# EAGLE schematic OLM-base-flora (EAGLE 6.4)
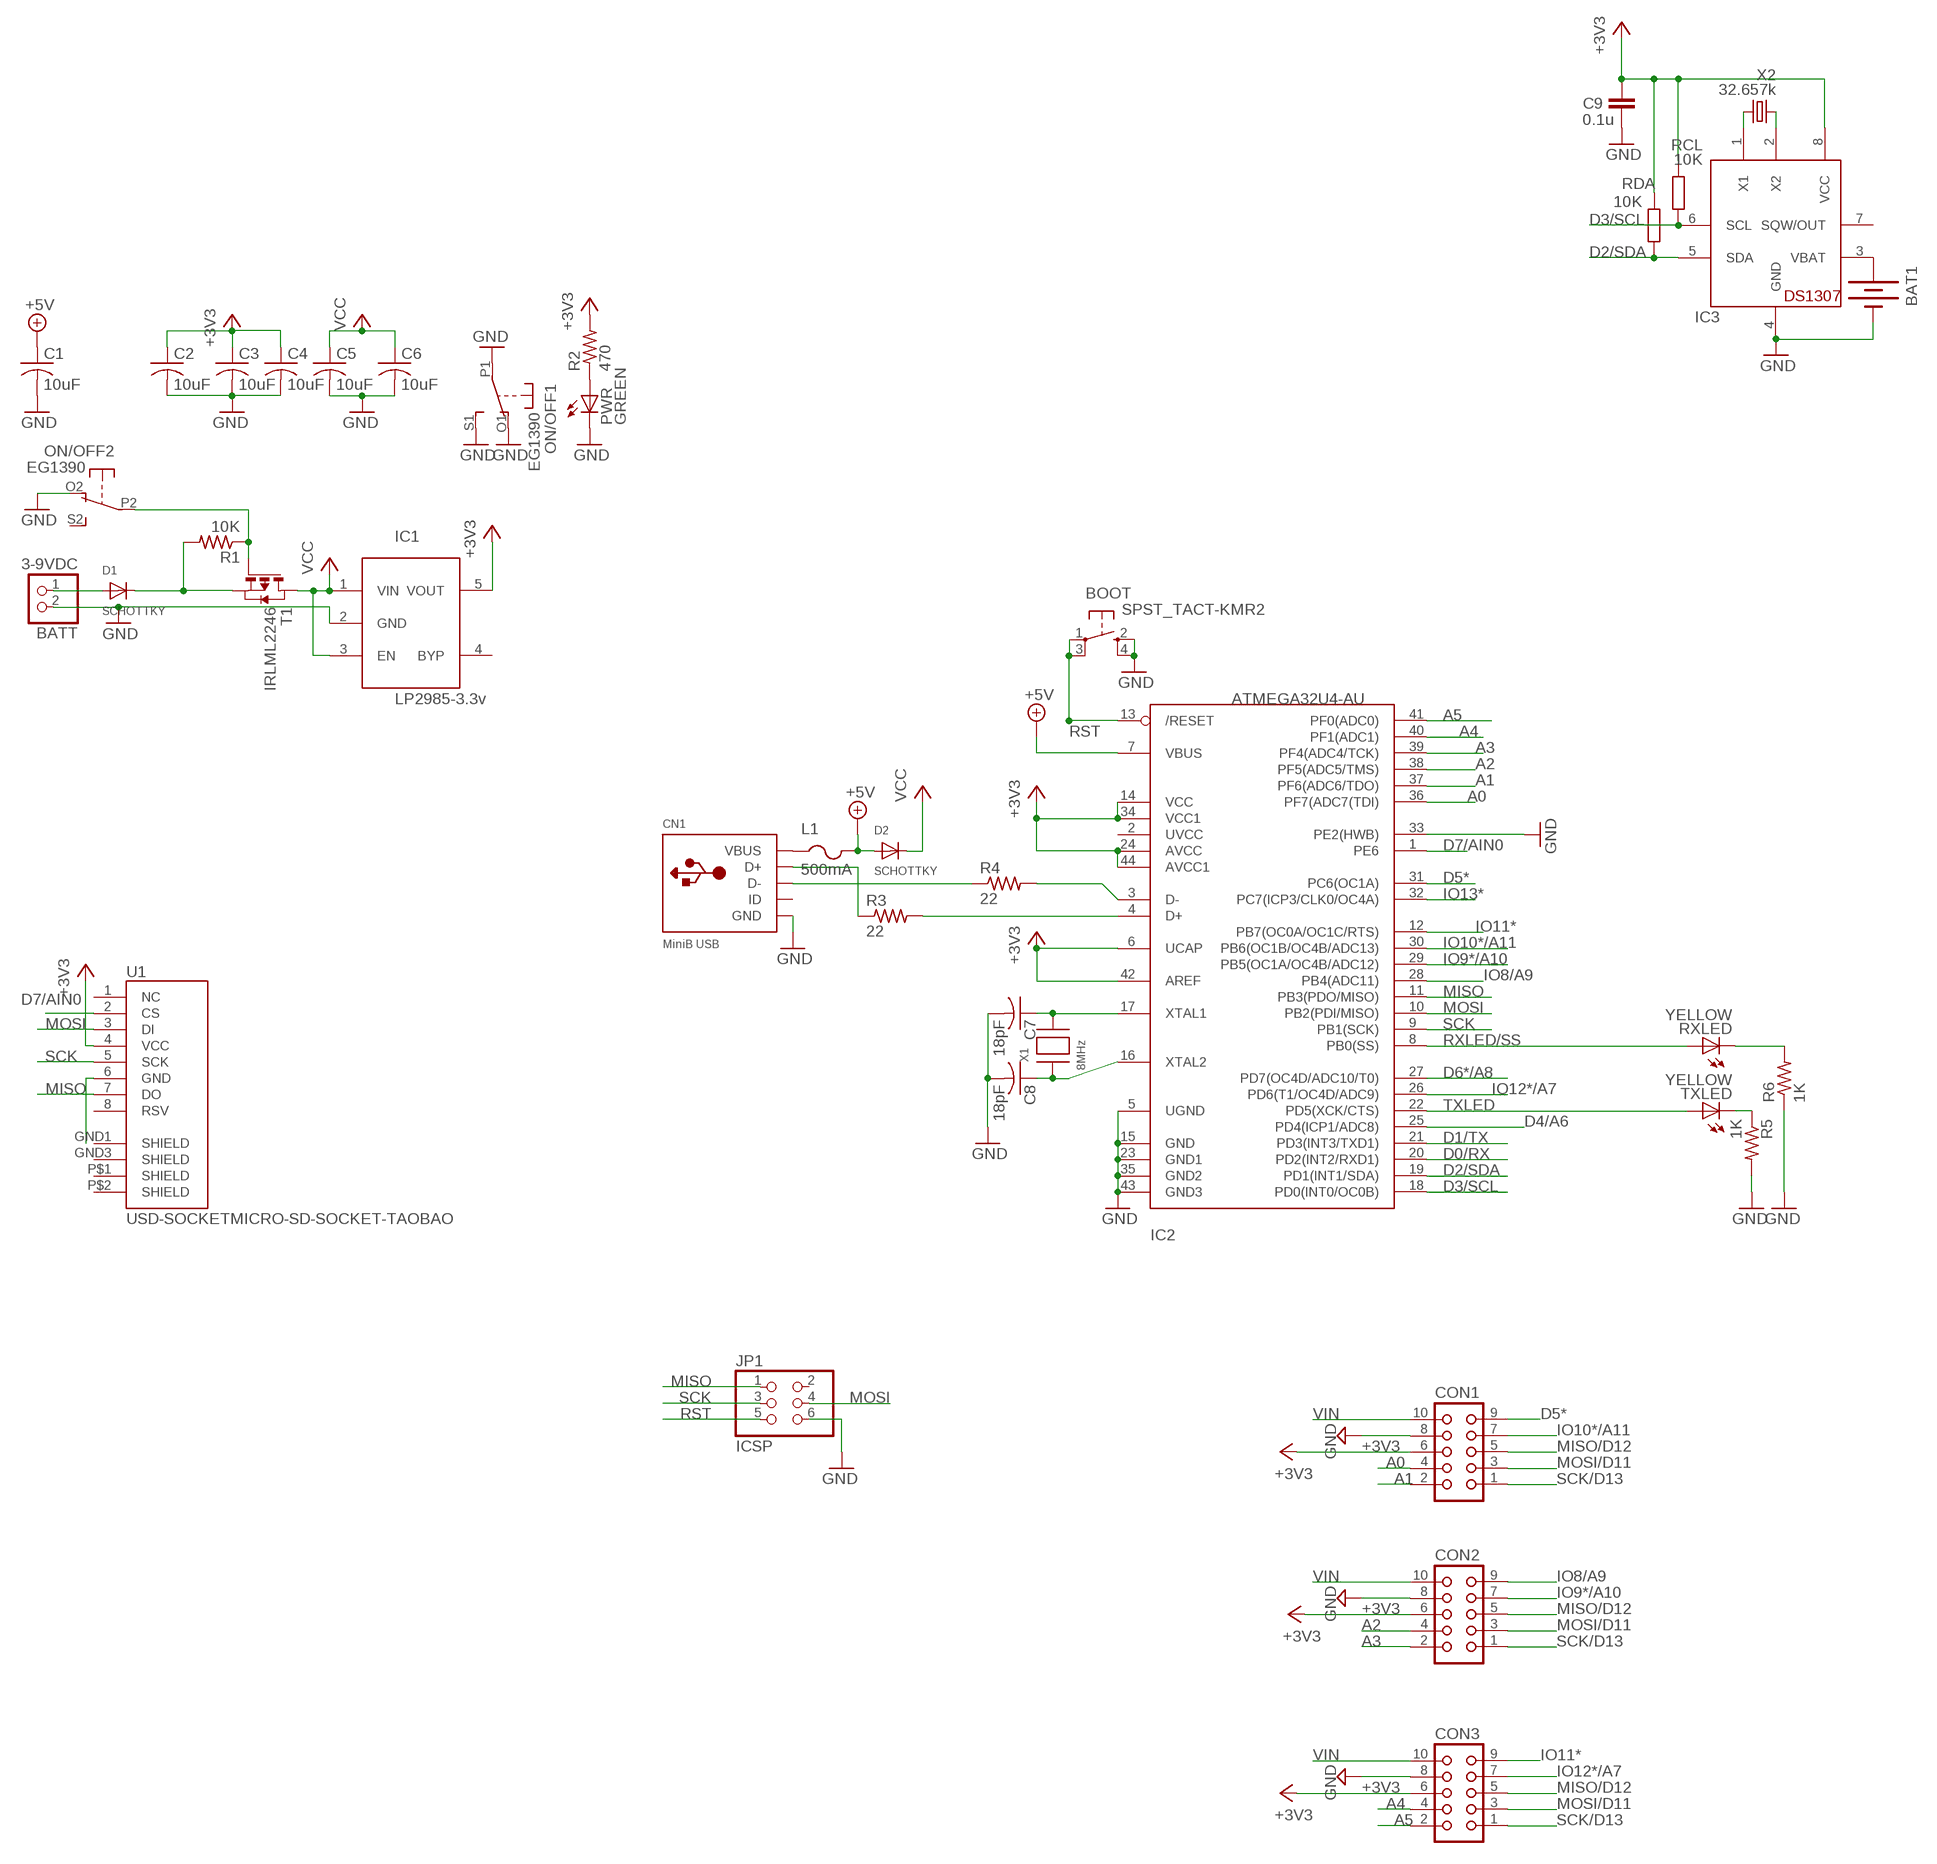
[diagram p0: schematic, sheet 1, part 1 of 2]
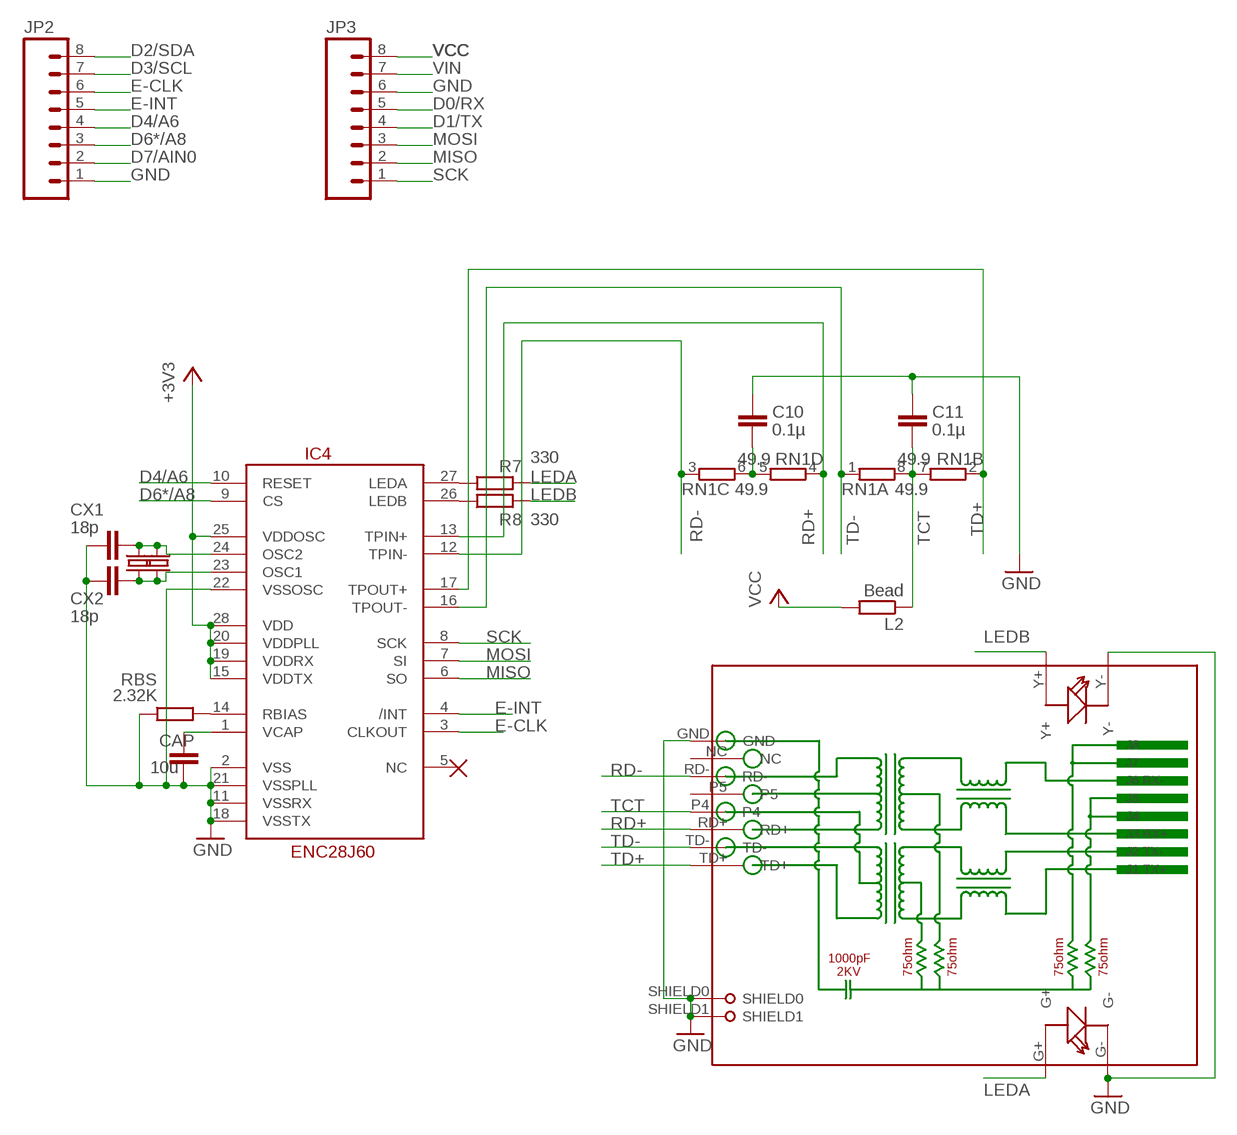
[diagram p1: schematic, sheet 1, part 2 of 2]

## Parts
BAT1  BATTERYBATTERY_12MM_SMT  [BATTCON_12MM_SMT]
BATT  3-9VDC  JST_2PIN-SMT-RA  [JST-PH-2-SMT-RA]
BOOT  SPST_TACT-KMR2  [KMR2]
C1  10uF  C-USC0805K  [C0805K]
C2  10uF  C-USC0805K  [C0805K]
C3  10uF  C-USC0805K  [C0805K]
C4  10uF  C-USC0805K  [C0805K]
C5  10uF  C-USC0805K  [C0805K]
C6  10uF  C-USC0805K  [C0805K]
C7  18pF  C-USC0805K  [C0805K]
C8  18pF  C-USC0805K  [C0805K]
C9  0.1u  C-EUC0805  [C0805]
C10  0.1µ  C-EUC0805  [C0805]
C11  0.1µ  C-EUC0805  [C0805]
CAP  10u  C-EUC0805  [C0805]
CN1  MiniB USB  USBMINIBLARGE  [USB-MINIB_LARGER]
CON1  CON10L  [CON10L]
CON2  CON10L  [CON10L]
CON3  CON10L  [CON10L]
CX1  18p  C-EUC0805  [C0805]
CX2  18p  C-EUC0805  [C0805]
D1  SCHOTTKY  DIODESOD-123  [SOD-123]
D2  SCHOTTKY  DIODESOD-123  [SOD-123]
IC1  LP2985-3.3v  LP298XS  [SOT23-5L]
IC2  ATMEGA32U4-AU  [TQFP44]
IC3  DS1307  DS1307SOIC  [SO08]
IC4  ENC28J60  ENC28J60SO28LONG  [SOIC28WLONG]
JP1  ICSP  PINHD-2X3  [2X03]
JP2  M08LOCK  [1X08_LOCK]
JP3  M08LOCK  [1X08_LOCK]
L1  500mA  PTCFUSE-1206  [R1206]
L2  Bead  R-EU_R0805  [R0805]
ON/OFF  EG1390  DPDT-EG1390  [EG1390]
PWR  GREEN  LEDCHIPLED_0805  [CHIPLED_0805]
R1  10K  R-US_R0805  [R0805]
R2  470  R-US_R0805  [R0805]
R3  22  R-US_R0805  [R0805]
R4  22  R-US_R0805  [R0805]
R5  1K  R-US_R0805  [R0805]
R6  1K  R-US_R0805  [R0805]
R7  330  R-EU_R0805  [R0805]
R8  330  R-EU_R0805  [R0805]
RBS  2.32K  R-EU_R0805  [R0805]
RCL  10K  R-EU_R0805  [R0805]
RDA  10K  R-EU_R0805  [R0805]
RJ1  HR911105A  [HR911105A]
RN1  49.9  4R-NEXB38V  [EXB38V]
RXLED  YELLOW  LEDCHIPLED_0805  [CHIPLED_0805]
T1  IRLML2246  PMOSSOT23  [SOT-23]
TXLED  YELLOW  LEDCHIPLED_0805  [CHIPLED_0805]
U1  USD-SOCKETMICRO-SD-SOCKET-TAOBAO  [MICRO-SD-SOCKET-TAOBAO]
X1  8MHz  XTALNX5032  [NX5032]
X2  32.657k  CRYSTALTC26H  [TC26H]
X2A  25MHz  CRYSTAL10.5X4.8  [CRYSTAL-SMD-10.5X4.8-2PIN]
X2A1  25MHz  CRYSTALHC49US  [HC49US]

## Nets
+3V3: C2.1 C3.1 C4.1 C9.1 CON1.6 CON2.6 CON3.6 IC1.5(VOUT) IC2.6(UCAP) IC2.14(VCC) IC2.24(AVCC) IC2.34(VCC1) IC2.42(AREF) IC2.44(AVCC1) IC3.8(VCC) IC4.15(VDDTX) IC4.19(VDDRX) IC4.20(VDDPLL) IC4.25(VDDOSC) IC4.28(VDD) R2.2 RCL.1 RDA.1 U1.4(VCC)
+5V: C1.1 D2.A IC2.7(VBUS) L1.2
A0: CON1.4 IC2.36(PF7(ADC7(TDI))
A1: CON1.2 IC2.37(PF6(ADC6/TDO))
A2: CON2.4 IC2.38(PF5(ADC5/TMS))
A3: CON2.2 IC2.39(PF4(ADC4/TCK))
A4: CON3.4 IC2.40(PF1(ADC1))
A5: CON3.2 IC2.41(PF0(ADC0))
D0/RX: IC2.20(PD2(INT2/RXD1)) JP3.5
D1/TX: IC2.21(PD3(INT3/TXD1)) JP3.4
D2/SDA: IC2.19(PD1(INT1/SDA)) IC3.5(SDA) JP2.8 RDA.2
D3/SCL: IC2.18(PD0(INT0/OC0B)) IC3.6(SCL) JP2.7 RCL.2
D4/A6: IC2.25(PD4(ICP1/ADC8)) IC4.10(RESET) JP2.4
D5*: CON1.9 IC2.31(PC6(OC1A))
D6*/A8: IC2.27(PD7(OC4D/ADC10/T0)) IC4.9(CS) JP2.3
D7/AIN0: IC2.1(PE6) JP2.2 U1.2(CS)
E-CLK: IC4.3(CLKOUT) JP2.6
E-INT: IC4.4(/INT) JP2.5
GND: BAT1.P$1(-) BATT.2 BOOT.2(S) BOOT.4(S1) C1.2 C2.2 C3.2 C4.2 C5.2 C6.2 C7.2 C8.2 C9.2 C10.1 C11.1 CAP.2 CN1.GND CON1.8 CON2.8 CON3.8 CX1.2 CX2.2 IC1.2(GND) IC2.5(UGND) IC2.15(GND) IC2.23(GND1) IC2.33(PE2(HWB)) IC2.35(GND2) IC2.43(GND3) IC3.4(GND) IC4.2(VSS) IC4.11(VSSRX) IC4.18(VSSTX) IC4.21(VSSPLL) IC4.22(VSSOSC) JP1.6 JP2.1 JP3.6 ON/OFF.O1(1:O) ON/OFF.O2(2:O) ON/OFF.P1(1:P) ON/OFF.S1(1:S) PWR.C R5.2 R6.1 RBS.1 RJ1.G- RJ1.GND RJ1.SHIELD0 RJ1.SHIELD1 RJ1.Y- U1.6(GND)
IO8/A9: CON2.9 IC2.28(PB4(ADC11))
IO9*/A10: CON2.7 IC2.29(PB5(OC1A/OC4B/ADC12))
IO10*/A11: CON1.7 IC2.30(PB6(OC1B/OC4B/ADC13))
IO11*: CON3.9 IC2.12(PB7(OC0A/OC1C/RTS))
IO12*/A7: CON3.7 IC2.26(PD6(T1/OC4D/ADC9))
IO13*: IC2.32(PC7(ICP3/CLK0/OC4A))
LEDA: R7.2 RJ1.G+
LEDB: R8.2 RJ1.Y+
MISO: IC2.11(PB3(PDO/MISO)) IC4.6(SO) JP1.1 JP3.2 U1.7(DO)
MISO/D12: CON1.5 CON2.5 CON3.5
MOSI: IC2.10(PB2(PDI/MISO)) IC4.7(SI) JP1.4 JP3.3 U1.3(DI)
MOSI/D11: CON1.3 CON2.3 CON3.3
N$1: PWR.A R2.1
N$2: CN1.D+ R3.1
N$3: IC2.3(D-) R4.2
N$4: IC2.4(D+) R3.2
N$5: CN1.D- R4.1
N$6: D1.C R1.2 T1.2(S)
N$7: BATT.1 D1.A
N$8: C7.1 IC2.17(XTAL1) X1.P$2
N$9: C8.1 IC2.16(XTAL2) X1.P$1
N$11: R5.1 TXLED.C
N$12: R6.2 RXLED.C
N$13: ON/OFF.P2(2:P) R1.1 T1.3(G)
N$34: IC4.27(LEDA) R7.1
N$36: BAT1.P$2(+) IC3.3(VBAT)
N$37: IC4.26(LEDB) R8.1
N$39: CAP.1 IC4.1(VCAP)
N$41: CX1.1 IC4.24(OSC2) X2A1.2 X2A.P$2
N$42: CX2.1 IC4.23(OSC1) X2A1.1 X2A.P$1
N$47: IC3.1(X1) X2.1
N$50: IC3.2(X2) X2.2
N$54: C10.2 RN1.5 RN1.6
N$59: IC4.14(RBIAS) RBS.2
RD+: IC4.13(TPIN+) RJ1.RD+ RN1.4
RD-: IC4.12(TPIN-) RJ1.RD- RN1.3
RST: BOOT.1(P) BOOT.3(P1) IC2.13(/RESET) JP1.5
RXLED/SS: IC2.8(PB0(SS)) RXLED.A
SCK: IC2.9(PB1(SCK)) IC4.8(SCK) JP1.3 JP3.1 U1.5(SCK)
SCK/D13: CON1.1 CON2.1 CON3.1
TCT: C11.2 L2.1 RJ1.P4 RN1.7 RN1.8
TD+: IC4.17(TPOUT+) RJ1.TD+ RN1.2
TD-: IC4.16(TPOUT-) RJ1.TD- RN1.1
TXLED: IC2.22(PD5(XCK/CTS)) TXLED.A
VBUS: CN1.VBUS L1.1
VCC: C5.1 C6.1 D2.C IC1.1(VIN) IC1.3(EN) JP3.8 L2.2 T1.1(D)
VIN: CON1.10 CON2.10 CON3.10 JP3.7
Unconnected: CN1.ID IC1.4(BYP) IC2.2(UVCC) IC3.7(SQW/OUT) IC4.5(NC) JP1.2 ON/OFF.S2(2:S) RJ1.NC RJ1.P5 U1.1(NC) U1.8(RSV) U1.GND1(SHIELD) U1.GND3(SHIELD) U1.P$1(SHIELD) U1.P$2(SHIELD)

## Library data of the parts
BAT1 = SparkFunNew:BATTERY: Battery Holders Various common sizes : AA, AAA, 20mm coin cell and 12mm coin cell.
BATT = adafruit:JST_2PIN: JST 2-Pin Connectors of various flavors SMT-RA (S2B-PH-SM4) 4UConnector #17311 SMT (B2B-PH-SM4) THM-RA (S2B-PH) THM (B2B-PH)
BOOT = adafruit:SPST_TACT: SMT 6mm switch, EVQQ2 series http://www.ladyada.net/library/eagle
C1-C8 = adafruit:C-US: CAPACITOR, American symbol
C9 = rcl:C-EU: CAPACITOR, European symbol
C10 C11 CAP CX1 CX2 = resistor:C-EU: CAPACITOR, European symbol
CN1 = microbuilder:USB: USB Connectors USBMINIB - Surface Mount Female Mini-B USB Connector 4UConnector: 06564
CON1-CON3 = con-harting:CON10L: CONNECTOR; OC_FARNELL: unknown; OC_NEWARK: unknown
D1 D2 = adafruit:DIODE: Diode SMADIODE - SMA Surface Mount Package 20V 1A Schottky Diode Digikey: 641-1014-6-ND DO-1N4148 - Through Hole Small Current Diode SOD-123 20V 1 A (.5mV Vf) Schottky Diode - Digikey: MBRX120TPMSCT-ND SOD-323 10V 570mA (.38mV Vf, 3ns) Schottky Diode - Digikey: ZLLS410CT-ND SOD-523 30V 30mA Schottky Diode (RB751S-40TE61) - Digikey: RB751S-40TE61CT-ND SOT23-R/W - SOT23 Package (R = Solder Paste/Reflow Ovens, W = Hand-Soldering) BAT54Film 40V 300mA - Digikey: 497-7162-1-ND
IC1 = adafruit:LP298X
IC2 = adaprog:ATMEGA32U4
IC3 = adafruit:DS1307: DS1307 Real time clock (RTC) with battery backup ability. Talk to it via i2c
IC4 = SparkFun:ENC28J60
JP1 = pinhead:PINHD-2X3: PIN HEADER
JP2 JP3 = SparkFun-Connectors:M08: Header 8 Standard 8-pin 0.1" header. Use with straight break away headers (SKU : PRT-00116), right angle break away headers (PRT-00553), swiss pins (PRT-00743), machine pins (PRT-00117), and female headers (PRT-00115).
L1 = adafruit:PTCFUSE: PTC fuses, resettable thermistors
L2 R7 R8 RBS RCL RDA = rcl:R-EU_: RESISTOR, European symbol
ON/OFF = adafruit:DPDT
PWR RXLED TXLED = adafruit:LED: LED OSRAM: - CHIPLED LG R971, LG N971, LY N971, LG Q971, LY Q971, LO R971, LY R971 LH N974, LH R974 LS Q976, LO Q976, LY Q976 LO Q996 - Hyper CHIPLED LW Q18S LB Q993, LB Q99A, LB R99A - SideLED LS A670, LO A670, LY A670, LG A670, LP A670 LB A673, LV A673, LT A673, LW A673 LH A674 LY A675 LS A676, LA A676, LO A676, LY A676, LW A676 LS A679, LY A679, LG A679 - Hyper Micro SIDELED® LS Y876, LA Y876, LO Y876, LY Y876 LT Y87S - SmartLED LW L88C, LW L88S LB L89C, LB L89S, LG L890 LS L89K, LO L89K, LY L89K LS L896, LA L896, LO L896, LY L896 - TOPLED LS T670, LO T670, LY T670, LG T670, LP T670 LSG T670, LSP T670, LSY T670, LOP T670, LYG T670 LG T671, LOG T671, LSG T671 LB T673, LV T673, LT T673, LW T673 LH T674 LS T676, LA T676, LO T676, LY T676, LB T676, LH T676, LSB T676, LW T676 LB T67C, LV T67C, LT T67C, LS T67K, LO T67K, LY T67K, LW E67C LS E67B, LA E67B, LO E67B, LY E67B, LB E67C, LV E67C, LT E67C LW T67C LS T679, LY T679, LG T679 LS T770, LO T770, LY T770, LG T770, LP T770 LB T773, LV T773, LT T773, LW T773 LH T774 LS E675, LA E675, LY E675, LS T675 LS T776, LA T776, LO T776, LY T776, LB T776 LHGB T686 LT T68C, LB T68C - Hyper Mini TOPLED® LB M676 - Mini TOPLED Santana® LG M470 LS M47K, LO M47K, LY M47K Source: http://www.osram.convergy.de/
R1-R6 = adafruit:R-US_: RESISTOR, American symbol
RJ1 = CONNECTER:HR911105A
RN1 = resistor-dil:4R-N: Array Chip Resistor Source: RS Component / Phycomp; OC_FARNELL: unknown; OC_NEWARK: unknown
T1 = zetex:PMOSSOT23: MOS FET
U1 = SparkFunNew:USD-SOCKET: microSD Socket Push-push type uSD socket. Schematic element and footprint production proven. Spark Fun Electronics SKU : PRT-00127. tDoc lines correctly indicate media card edge positions when inserting (unlocked, locked, depressed).
X1 = adaprog:XTAL
X2 = crystal:CRYSTAL: CRYSTAL; OC_FARNELL: unknown; OC_NEWARK: unknown
X2A X2A1 = SparkFun:CRYSTAL: Crystals Various standard crystals. Proven footprints. Spark Fun Electronics SKU : COM-00534

## Net classes
0 default: width 0.305 mm, clearance 0.203 mm
1 vcc: width 0.254 mm